# EAGLE design B156A (EAGLE 6.6.0)
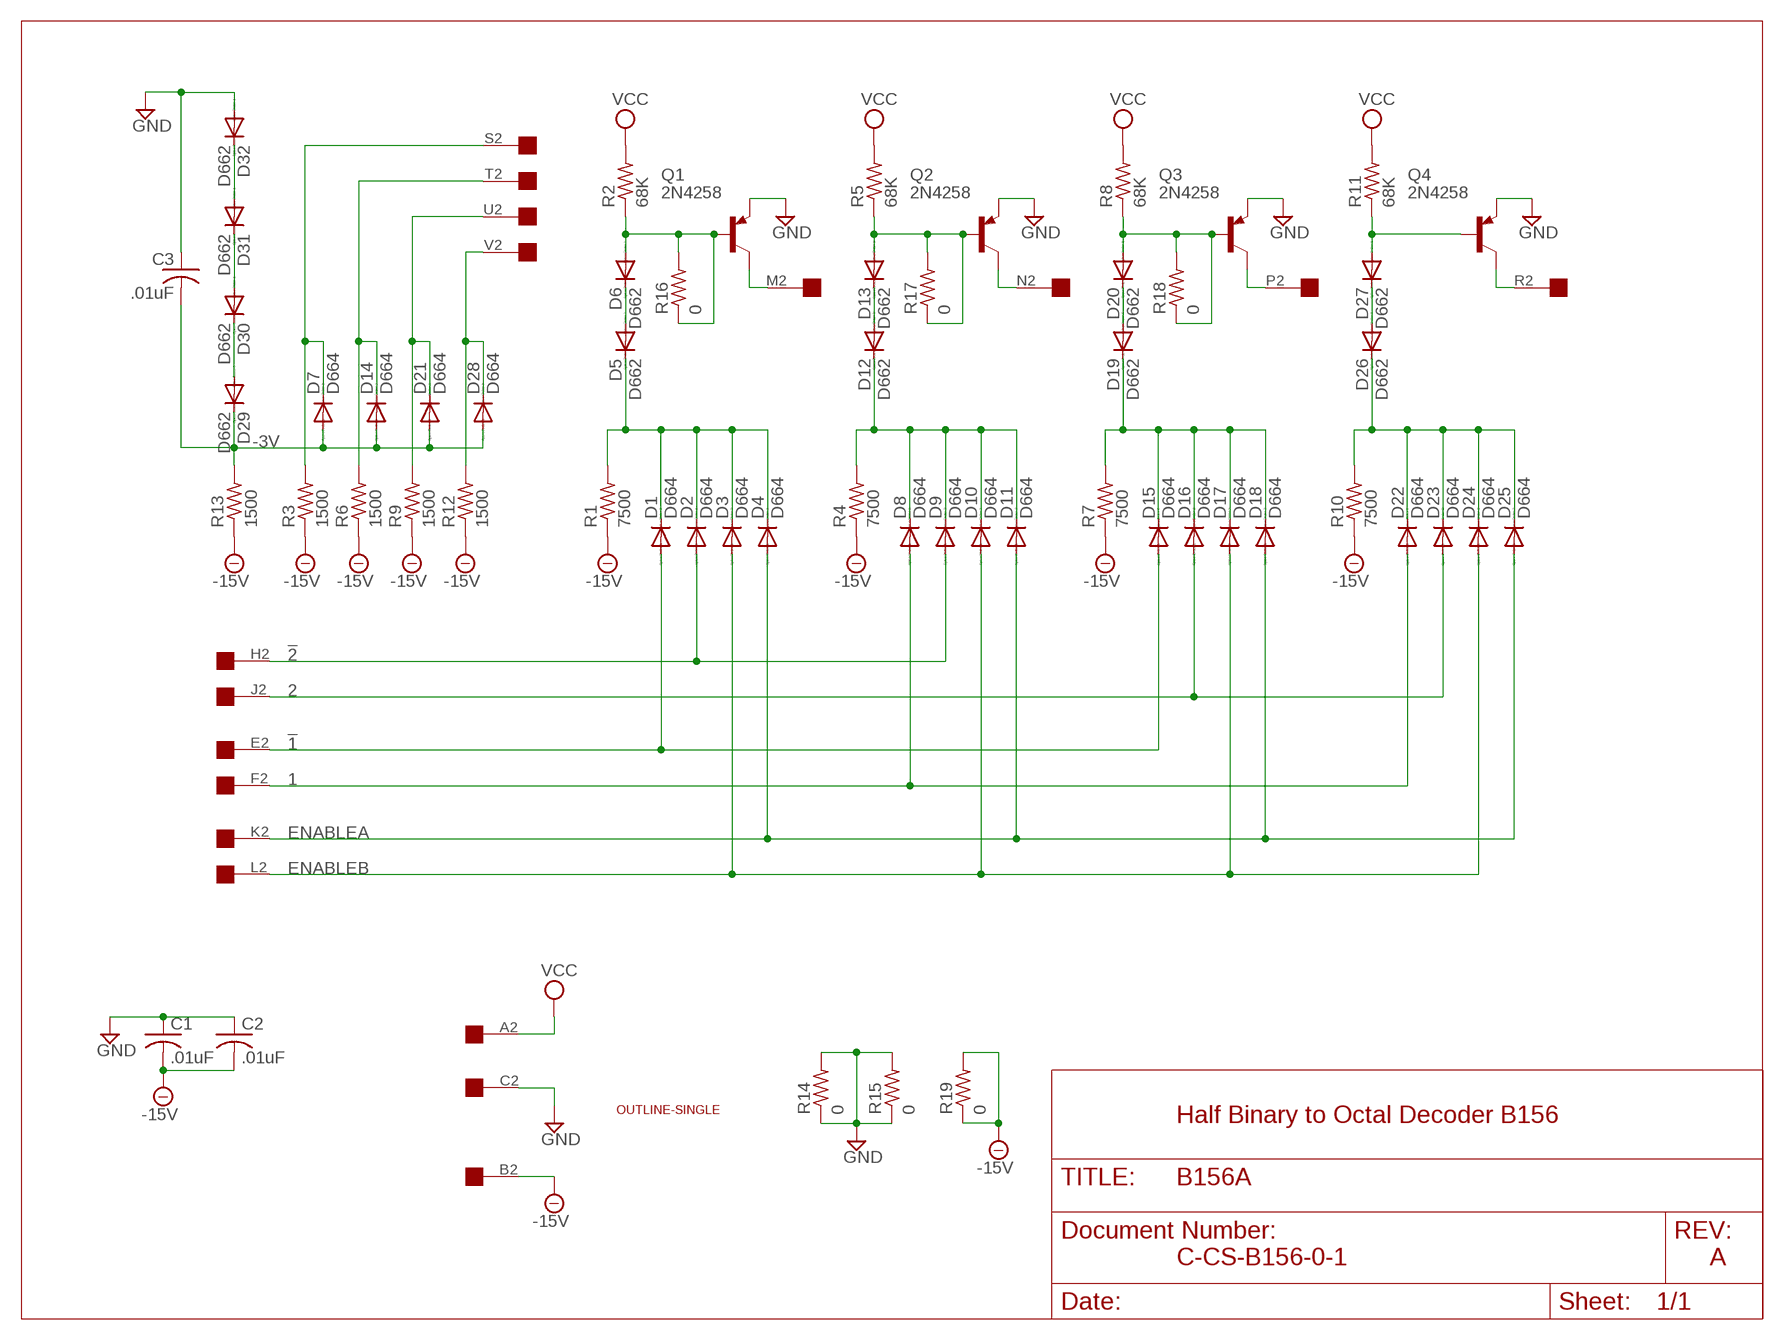
[diagram p0: schematic, sheet 1]

## Parts
C1  .01uF  C-US  [C063-025X075]
C2  .01uF  C-US  [C063-025X075]
C3  .01uF  C-US  [C063-025X075]
D1  D664  DIODE-DO35-10  [DO35-10]
D2  D664  DIODE-DO35-10  [DO35-10]
D3  D664  DIODE-DO35-10  [DO35-10]
D4  D664  DIODE-DO35-10  [DO35-10]
D5  D662  DIODE-DO35-10  [DO35-10]
D6  D662  DIODE-DO35-10  [DO35-10]
D7  D664  DIODE-DO35-10  [DO35-10]
D8  D664  DIODE-DO35-10  [DO35-10]
D9  D664  DIODE-DO35-10  [DO35-10]
D10  D664  DIODE-DO35-10  [DO35-10]
D11  D664  DIODE-DO35-10  [DO35-10]
D12  D662  DIODE-DO35-10  [DO35-10]
D13  D662  DIODE-DO35-10  [DO35-10]
D14  D664  DIODE-DO35-10  [DO35-10]
D15  D664  DIODE-DO35-10  [DO35-10]
D16  D664  DIODE-DO35-10  [DO35-10]
D17  D664  DIODE-DO35-10  [DO35-10]
D18  D664  DIODE-DO35-10  [DO35-10]
D19  D662  DIODE-DO35-10  [DO35-10]
D20  D662  DIODE-DO35-10  [DO35-10]
D21  D664  DIODE-DO35-10  [DO35-10]
D22  D664  DIODE-DO35-10  [DO35-10]
D23  D664  DIODE-DO35-10  [DO35-10]
D24  D664  DIODE-DO35-10  [DO35-10]
D25  D664  DIODE-DO35-10  [DO35-10]
D26  D662  DIODE-DO35-10  [DO35-10]
D27  D662  DIODE-DO35-10  [DO35-10]
D28  D664  DIODE-DO35-10  [DO35-10]
D29  D662  DIODE-DO35-10  [DO35-10]
D30  D662  DIODE-DO35-10  [DO35-10]
D31  D662  DIODE-DO35-10  [DO35-10]
D32  D662  DIODE-DO35-10  [DO35-10]
Q1  2N4258  -PNP-TO5  [TO5]
Q2  2N4258  -PNP-TO5  [TO5]
Q3  2N4258  -PNP-TO5  [TO5]
Q4  2N4258  -PNP-TO5  [TO5]
R1  7500  R-US_0207/10  [0207/10]
R2  68K  R-US_0207/10  [0207/10]
R3  1500  R-US_0207/10  [0207/10]
R4  7500  R-US_0207/10  [0207/10]
R5  68K  R-US_0207/10  [0207/10]
R6  1500  R-US_0207/10  [0207/10]
R7  7500  R-US_0207/10  [0207/10]
R8  68K  R-US_0207/10  [0207/10]
R9  1500  R-US_0207/10  [0207/10]
R10  7500  R-US_0207/10  [0207/10]
R11  68K  R-US_0207/10  [0207/10]
R12  1500  R-US_0207/10  [0207/10]
R13  1500  R-US_0207/10  [0207/10]
R14  0  R-US_0207/10  [0207/10]
R15  0  R-US_0207/10  [0207/10]
R16  0  R-US_0207/10  [0207/10]
R17  0  R-US_0207/10  [0207/10]
R18  0  R-US_0207/10  [0207/10]
R19  0  R-US_0207/10  [0207/10]
U$1  OUTLINE-SINGLE  [SINGLE]
U$2  EDGE-1  [EDGE-CON1]

## Nets
1: D8.A D22.A U$2.F2
2: D16.A D23.A U$2.J2
!1: D1.A D15.A U$2.E2
!2: D2.A D9.A U$2.H2
-3V: C3.2 D7.A D14.A D21.A D28.A D29.C R13.2
-15V: C1.2 C2.2 R1.1 R3.1 R4.1 R6.1 R7.1 R9.1 R10.1 R12.1 R13.1 R19.1 R19.2 U$2.B2
ENABLEA: D4.A D11.A D18.A D25.A U$2.K2
ENABLEB: D3.A D10.A D17.A D24.A U$2.L2
GND: C1.1 C2.1 C3.1 D32.A Q1.1(E) Q2.1(E) Q3.1(E) Q4.1(E) R14.1 R14.2 R15.1 R15.2 U$2.C2
N$1: D31.A D32.C
N$2: D29.A D30.C
N$3: D7.C R3.2 U$2.S2
N$5: D30.A D31.C
N$6: D14.C R6.2 U$2.T2
N$7: D21.C R9.2 U$2.U2
N$8: D28.C R12.2 U$2.V2
N$9: D1.C D2.C D3.C D4.C D5.C R1.2
N$10: D8.C D9.C D10.C D11.C D12.C R4.2
N$12: D5.A D6.C
N$13: D6.A Q1.2(B) R2.1 R16.1 R16.2
N$14: Q1.3(C) U$2.M2
N$15: D15.C D16.C D17.C D18.C D19.C R7.2
N$17: D12.A D13.C
N$18: D13.A Q2.2(B) R5.1 R17.1 R17.2
N$19: Q2.3(C) U$2.N2
N$20: D22.C D23.C D24.C D25.C D26.C R10.2
N$22: D19.A D20.C
N$23: D20.A Q3.2(B) R8.1 R18.1 R18.2
N$24: Q3.3(C) U$2.P2
N$27: D26.A D27.C
N$28: D27.A Q4.2(B) R11.1
N$29: Q4.3(C) U$2.R2
VCC: R2.2 R5.2 R8.2 R11.2 U$2.A2
Unconnected: U$2.D2

## Notes on the sheet
- Half Binary to Octal Decoder B156
- C-CS-B156-0-1 | A

## Library data of the parts
C1-C3 = dec-con:C-US: Capacitors with funky DEC lead spacing.
D1-D32 = diode:DIODE-: DIODE
Q1-Q4 = transistor:*-PNP-: PNP Transistror
R1-R19 = rcl:R-US_: RESISTOR, American symbol
U$1 = dec-con:OUTLINE-*: Board outlines for DEC boards.
U$2 = dec-con:EDGE-1: Single-Sided DEC Edge Connector -- (side 2)

## Board
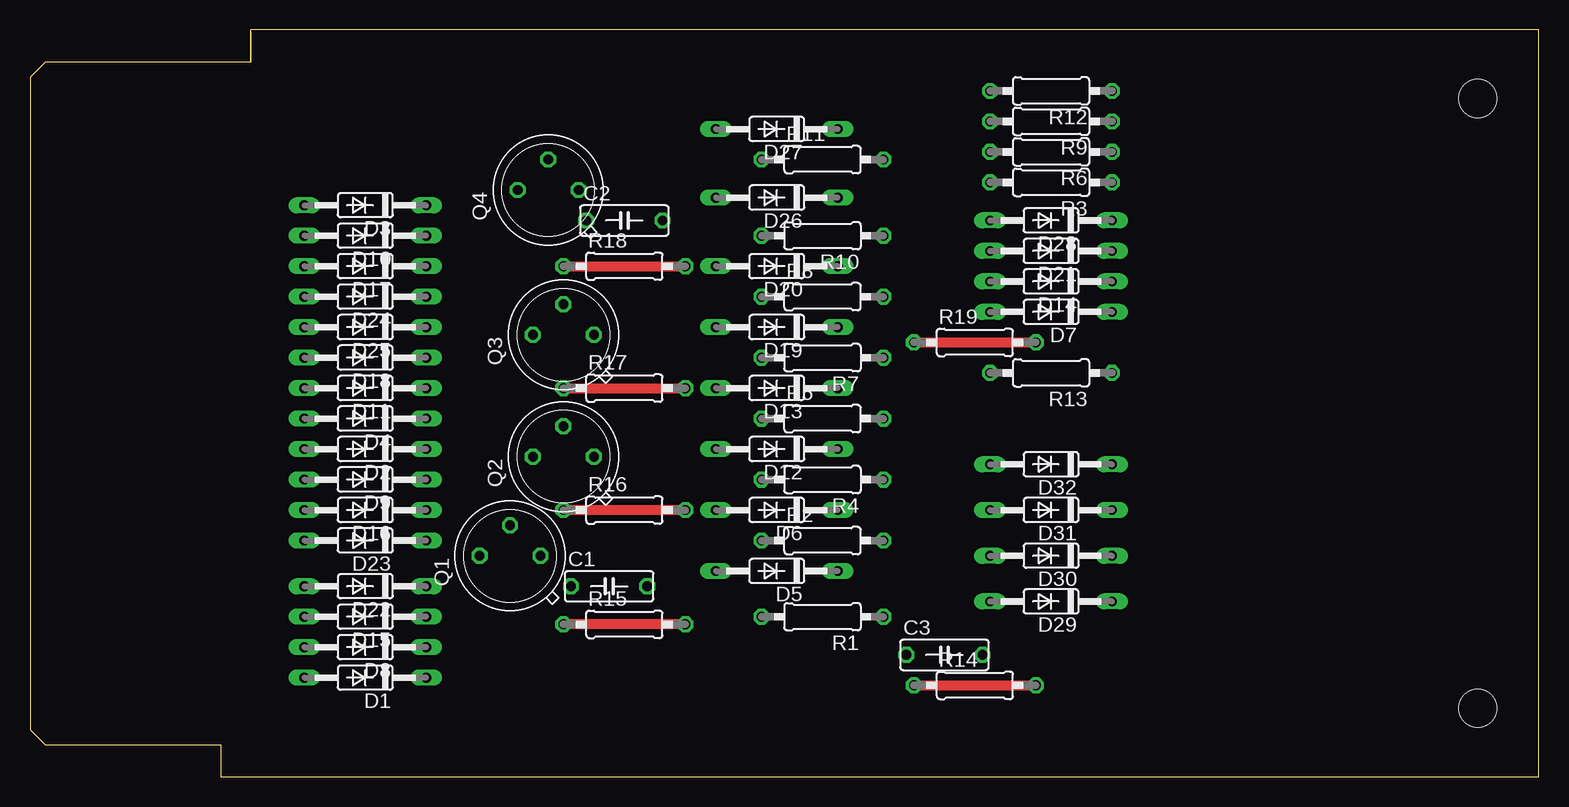
[diagram p1: board, top side]
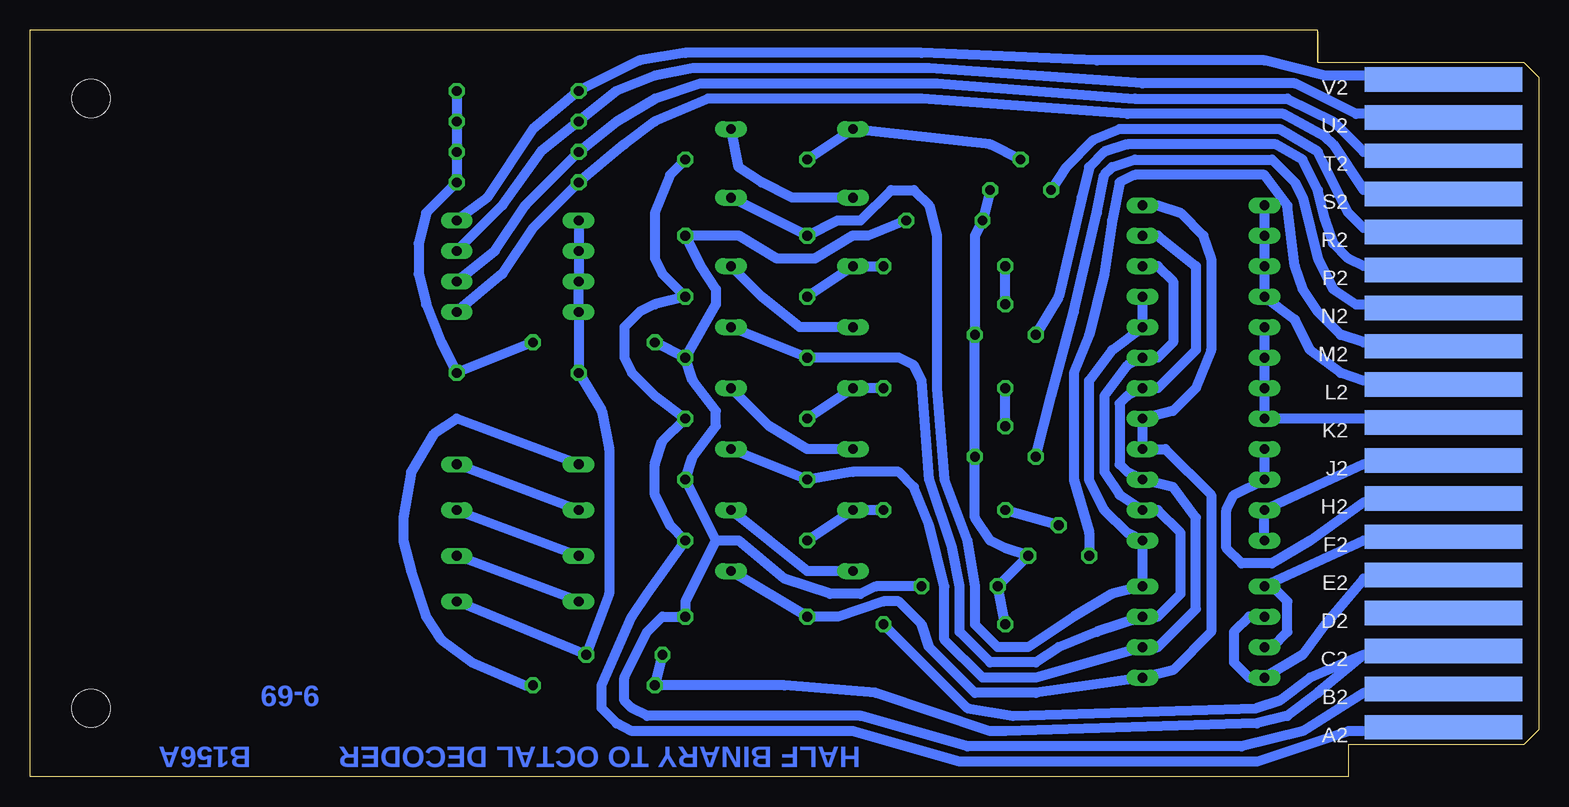
[diagram p2: board, bottom side, seen from below]

Size 125.73 x 62.23 mm. Coordinates in mm from the lower left corner, seen from the top.
Copper layers (1+16): Top 0.035mm / dielectric 1.5mm / Bottom 0.035mm
Design rules "16mils": minimum track width 16mil, minimum drill 32mil, track to track 15mil, track to pad 10mil, pad to pad 10mil, via to via 10mil, smd to smd 10mil, copper to edge 13mil, drill to drill 10mil, minimum pad ring 10mil, minimum via ring 8mil, stop-mask expansion 0mil, vias tented up to drill 0mil, thermal gap 10mil

### Footprints (pad centres in the part's own frame; a part is rotated, then mirrored left to right if it is on the bottom)
C063-025X075 = drill 0.813 octagon: 1 -2.54,0; 2 3.81,0
DO35-10 = drill 0.813 long: A 5.08,0; C -5.08,0
TO5 = drill 0.813 octagon: 1 0,-2.54; 2 2.54,0; 3 0,2.54
0207/10 = drill 0.813 octagon: 1 -5.08,0; 2 5.08,0
SINGLE = hole 3.175: 120.65,56.515; 120.65,5.715
EDGE-CON1 = smd 13.106 x 2.032 bottom: A2 7.938,4.128; B2 7.938,7.303; C2 7.938,10.477; D2 7.938,13.652; E2 7.938,16.828; F2 7.938,20.003; H2 7.938,23.177; J2 7.938,26.352; K2 7.938,29.527; L2 7.938,32.703; M2 7.938,35.877; N2 7.938,39.053; P2 7.938,42.227; R2 7.938,45.403; S2 7.938,48.578; T2 7.938,51.752; U2 7.938,54.928; V2 7.938,58.102

### Placement (x,y rotation side)
C1  47.63,15.88 0 top
C2  48.9,46.35 0 top
C3  75.57,10.16 0 top
D1  27.94,8.26 180 top
D2  27.94,27.3 180 top
D3  27.94,47.62 180 top
D4  27.94,29.84 180 top
D5  62.23,17.14 180 top
D6  62.23,22.23 180 top
D7  85.09,38.73 180 top
D8  27.94,10.79 180 top
D9  27.94,24.77 180 top
D10  27.94,45.09 180 top
D11  27.94,32.38 180 top
D12  62.23,27.3 180 top
D13  62.23,32.38 180 top
D14  85.09,41.27 180 top
D15  27.94,13.34 180 top
D16  27.94,22.23 180 top
D17  27.94,42.55 180 top
D18  27.94,34.92 180 top
D19  62.23,37.47 180 top
D20  62.23,42.55 180 top
D21  85.09,43.81 180 top
D22  27.94,15.88 180 top
D23  27.94,19.68 180 top
D24  27.94,40.01 180 top
D25  27.94,37.47 180 top
D26  62.23,48.26 180 top
D27  62.23,53.98 180 top
D28  85.09,46.35 180 top
D29  85.09,14.61 180 top
D30  85.09,18.41 180 top
D31  85.09,22.23 180 top
D32  85.09,26.04 180 top
Q1  40.01,18.41 90 top
Q2  44.45,26.67 90 top
Q3  44.45,36.83 90 top
Q4  43.18,48.9 90 top
R1  66.04,13.34 180 top
R2  66.04,19.68 0 top
R3  85.09,49.53 180 top
R4  66.04,24.77 180 top
R5  66.04,29.84 0 top
R6  85.09,52.07 180 top
R7  66.04,34.92 180 top
R8  66.04,40.01 0 top
R9  85.09,54.61 180 top
R10  66.04,45.09 180 top
R11  66.04,51.44 0 top
R12  85.09,57.15 180 top
R13  85.09,33.66 180 top
R14  78.74,7.62 0 top
R15  49.53,12.7 0 top
R16  49.53,22.23 0 top
R17  49.53,32.38 0 top
R18  49.53,42.55 0 top
R19  78.74,36.2 0 top
U$1  0,0 0 top
U$2  0,0 0 top

### Tracks (layer width: path | path; a pad name or v marks a point on that pad's centre or on a via)
1
  Bottom 0.813: D8.A 22.23,10.79 20.96,12.06 20.96,14.61 22.23,15.88 D22.A 14.61,19.68 8.26,19.68 U$2.F2
2
  Bottom 0.813: U$2.J2 8.89,26.04 14.61,26.04 D16.A D23.A
!1
  Bottom 0.813: U$2.E2 8.89,16.51 14.61,16.51 17.78,12.7 19.69,10.16 D1.A 24.13,8.26 25.4,9.53 25.4,12.06 24.13,13.34 D15.A
!2
  Bottom 0.813: U$2.H2 8.89,22.86 14.61,22.86 19.05,19.68 22.23,17.78 24.77,17.78 26.04,19.05 26.04,22.23 25.4,23.5 D9.A D2.A
-3V
  Bottom 0.813: D28.A D21.A D14.A D7.A R13.2 78.11,30.48 77.47,27.3 77.47,15.24 C3.2 D29.C
-15V
  Top 0.813: R19.1 R19.2
  Bottom 0.813: R12.1 R9.1 R6.1 R3.1 92.71,46.99 93.35,44.45 93.35,41.91 92.71,39.37 91.44,36.2 R13.1 R19.2 | C1.2 55.25,15.88 56.52,15.24 59.06,15.24 62.87,16.51 66.68,19.68 68.58,19.68 | 68.58,19.68 71.12,14.61 R1.1 73.03,13.34 74.3,12.06 76.2,8.26 76.2,6.35 75.57,5.71 74.3,5.08 56.52,5.08 47.63,2.54 24.77,2.54 19.69,3.81 14.61,6.99 9.53,6.99 U$2.B2 | 68.58,19.68 R4.1 70.49,26.67 68.58,29.21 68.58,30.48 70.49,33.02 R7.1 | R7.1 R19.1 | R7.1 68.58,39.37 68.58,40.64 69.85,42.55 R10.1 66.68,45.09 63.5,43.18 60.33,43.18 57.15,45.09 55.88,45.09 C2.2
ENABLEA
  Bottom 0.813: U$2.K2 8.89,29.84 D4.A D11.A D18.A D25.A
ENABLEB
  Bottom 0.813: U$2.L2 8.89,33.02 14.61,33.02 16.51,33.66 19.05,35.56 20.32,38.1 D24.A D17.A D10.A D3.A
GND
  Top 0.813: R14.1 R14.2 | R15.2 R15.1
  Bottom 0.813: D32.A 90.17,29.84 92.08,28.57 93.98,25.4 94.62,21.59 94.62,19.68 93.98,17.14 92.71,13.34 91.44,11.43 88.9,9.53 84.46,7.62 R14.2 | C3.1 R14.1 62.87,7.62 55.25,6.99 45.72,3.81 44.45,3.81 23.5,4.45 20.96,5.08 18.42,6.99 14.61,10.16 | R15.1 C1.1 Q1.1 44.45,19.05 45.72,19.68 46.99,21.59 Q2.1 Q3.1 46.99,45.09 C2.1 Q4.1 | R15.2 47.63,5.71 43.82,5.08 23.5,5.71 21.59,6.35 19.05,8.26 14.61,10.16 | U$2.C2 8.89,10.16 14.61,10.16
N$1
  Bottom 0.813: D31.A D32.C
N$2
  Bottom 0.813: D29.A D30.C
N$3
  Bottom 0.813: D7.C 86.36,41.91 83.82,45.72 R3.2 76.2,52.7 73.66,54.61 69.22,56.52 51.44,56.52 34.29,55.24 21.27,55.24 17.78,53.34 17.15,52.7 14.61,48.9 8.26,48.9 U$2.S2
N$5
  Bottom 0.813: D31.C D30.A
N$6
  Bottom 0.813: D14.C 87,43.81 84.46,47.62 R6.2 76.84,54.61 73.66,56.52 69.85,57.78 50.17,57.78 33.66,56.52 20.96,56.52 17.15,54.61 14.61,52.07 8.89,52.07 U$2.T2
N$7
  Bottom 0.813: D21.C 86.36,47.62 83.19,52.07 R9.2 76.84,57.15 73.66,58.42 70.49,59.05 50.8,59.05 33.02,57.78 20.32,57.78 15.24,55.24 8.89,55.24 U$2.U2
N$8
  Bottom 0.813: U$2.V2 8.89,58.1 8.89,58.42 17.78,58.42 22.86,59.69 36.83,59.69 51.44,60.33 71.12,60.33 74.93,59.69 R12.2 83.82,53.98 87.63,48.26 D28.C
N$9
  Bottom 0.813: D5.C R1.2 58.42,13.34 54.61,14.61 53.34,14.61 51.44,12.7 50.8,10.79 46.99,6.99 41.91,6.99 D1.C 30.48,8.89 27.31,12.06 27.31,23.5 31.12,27.3 D2.C D4.C 30.48,30.48 28.58,32.38 27.31,35.56 27.31,43.18 27.94,45.09 29.85,46.99 31.75,47.62 D3.C
N$10
  Bottom 0.813: D10.C 31.75,45.09 28.58,42.55 28.58,35.56 31.75,32.38 D11.C 34.29,31.75 34.93,31.11 34.93,26.04 34.29,25.4 D9.C 30.48,24.13 28.58,21.59 28.58,13.97 31.75,10.79 D8.C 41.91,8.26 46.36,8.26 49.53,11.43 49.53,15.88 50.8,20.95 52.07,24.13 53.34,25.4 57.15,25.4 R4.2 D12.C
N$12
  Bottom 0.813: D5.A 60.96,17.14 D6.C
N$13
  Top 0.813: R16.2 R16.1
  Bottom 0.813: Q1.2 R16.1 | R2.1 D6.A R16.2
N$14
  Bottom 0.813: U$2.M2 9.53,36.2 14.61,36.2 16.51,36.83 18.42,38.73 19.69,40.64 20.32,42.55 20.96,47.62 22.86,50.16 33.66,50.16 34.93,49.53 35.56,46.35 36.2,41.91 37.47,36.83 38.74,33.66 38.74,24.77 37.47,20.32 Q1.3
N$15
  Bottom 0.813: D19.C R7.2 53.34,34.92 52.07,34.29 51.44,33.02 50.8,24.77 48.9,19.05 48.26,15.88 48.26,12.06 45.72,9.53 41.91,9.53 40.01,10.79 36.83,12.06 D15.C 31.75,13.34 29.85,15.24 29.85,20.32 31.75,22.23 D16.C 34.93,23.5 36.2,25.4 36.2,31.75 34.29,34.29 D18.C 31.75,34.92 30.48,36.2 30.48,41.27 31.75,42.55 D17.C
N$17
  Bottom 0.813: D12.A 60.96,27.3 64.14,29.21 D13.C
N$18
  Top 0.813: R17.1 R17.2
  Bottom 0.813: Q2.2 R17.1 | R17.2 D13.A R5.1
N$19
  Bottom 0.813: Q2.3 40.64,31.75 38.74,38.73 36.83,46.99 36.2,50.16 35.56,50.8 33.66,51.44 22.23,51.44 20.32,49.53 19.69,48.26 18.42,43.18 17.15,40.64 15.24,39.37 8.89,39.37 U$2.N2
N$20
  Bottom 0.813: D26.C R10.2 58.42,46.35 56.52,46.35 53.98,48.9 52.07,48.9 50.8,47.62 50.17,45.09 50.17,32.38 49.53,24.77 47.63,19.68 46.99,15.88 46.99,12.7 45.09,10.79 42.55,10.79 38.74,13.34 35.56,15.24 D22.C D23.C 34.29,20.32 36.2,22.23 37.47,24.77 37.47,33.02 35.56,35.56 D25.C D24.C
N$22
  Bottom 0.813: D19.A 61.6,37.47 64.77,40.01 D20.C
N$23
  Top 0.813: R18.1 R18.2
  Bottom 0.813: Q3.2 R18.1 | R8.1 D20.A R18.2
N$24
  Bottom 0.813: U$2.P2 9.53,42.55 14.61,42.55 15.88,43.18 17.15,44.45 17.78,46.35 18.42,48.9 19.69,51.44 21.91,52.7 34.29,52.7 36.2,52.07 37.47,50.8 38.1,48.26 40.01,40.01 Q3.3
N$27
  Bottom 0.813: D26.A 62.23,48.26 64.77,49.53 66.68,50.8 D27.C
N$28
  Bottom 0.813: Q4.2 45.72,52.7 D27.A R11.1
N$29
  Bottom 0.813: U$2.R2 8.89,45.72 14.61,45.72 15.88,46.99 18.42,52.07 21.59,53.98 34.93,53.98 37.15,53.02 39.37,50.8 Q4.3
VCC
  Bottom 0.813: U$2.A2 8.89,3.81 15.88,3.81 23.5,1.27 48.26,1.27 57.15,3.81 75.57,3.81 76.84,4.45 78.11,5.71 78.11,7.62 75.57,13.34 74.3,15.24 R2.2 72.39,20.95 73.66,23.5 73.66,26.04 73.03,27.94 R5.2 73.66,31.75 75.57,33.66 76.2,34.92 76.2,37.47 74.93,38.73 73.66,39.37 R8.2 73.03,41.91 73.66,43.18 73.66,46.99 72.39,50.16 R11.2

### Text on the board
Bottom: 9-69 | HALF BINARY TO OCTAL DECODER | B156A